# EAGLE design wt11i_breakout_board_v21 (EAGLE 6.5.0)
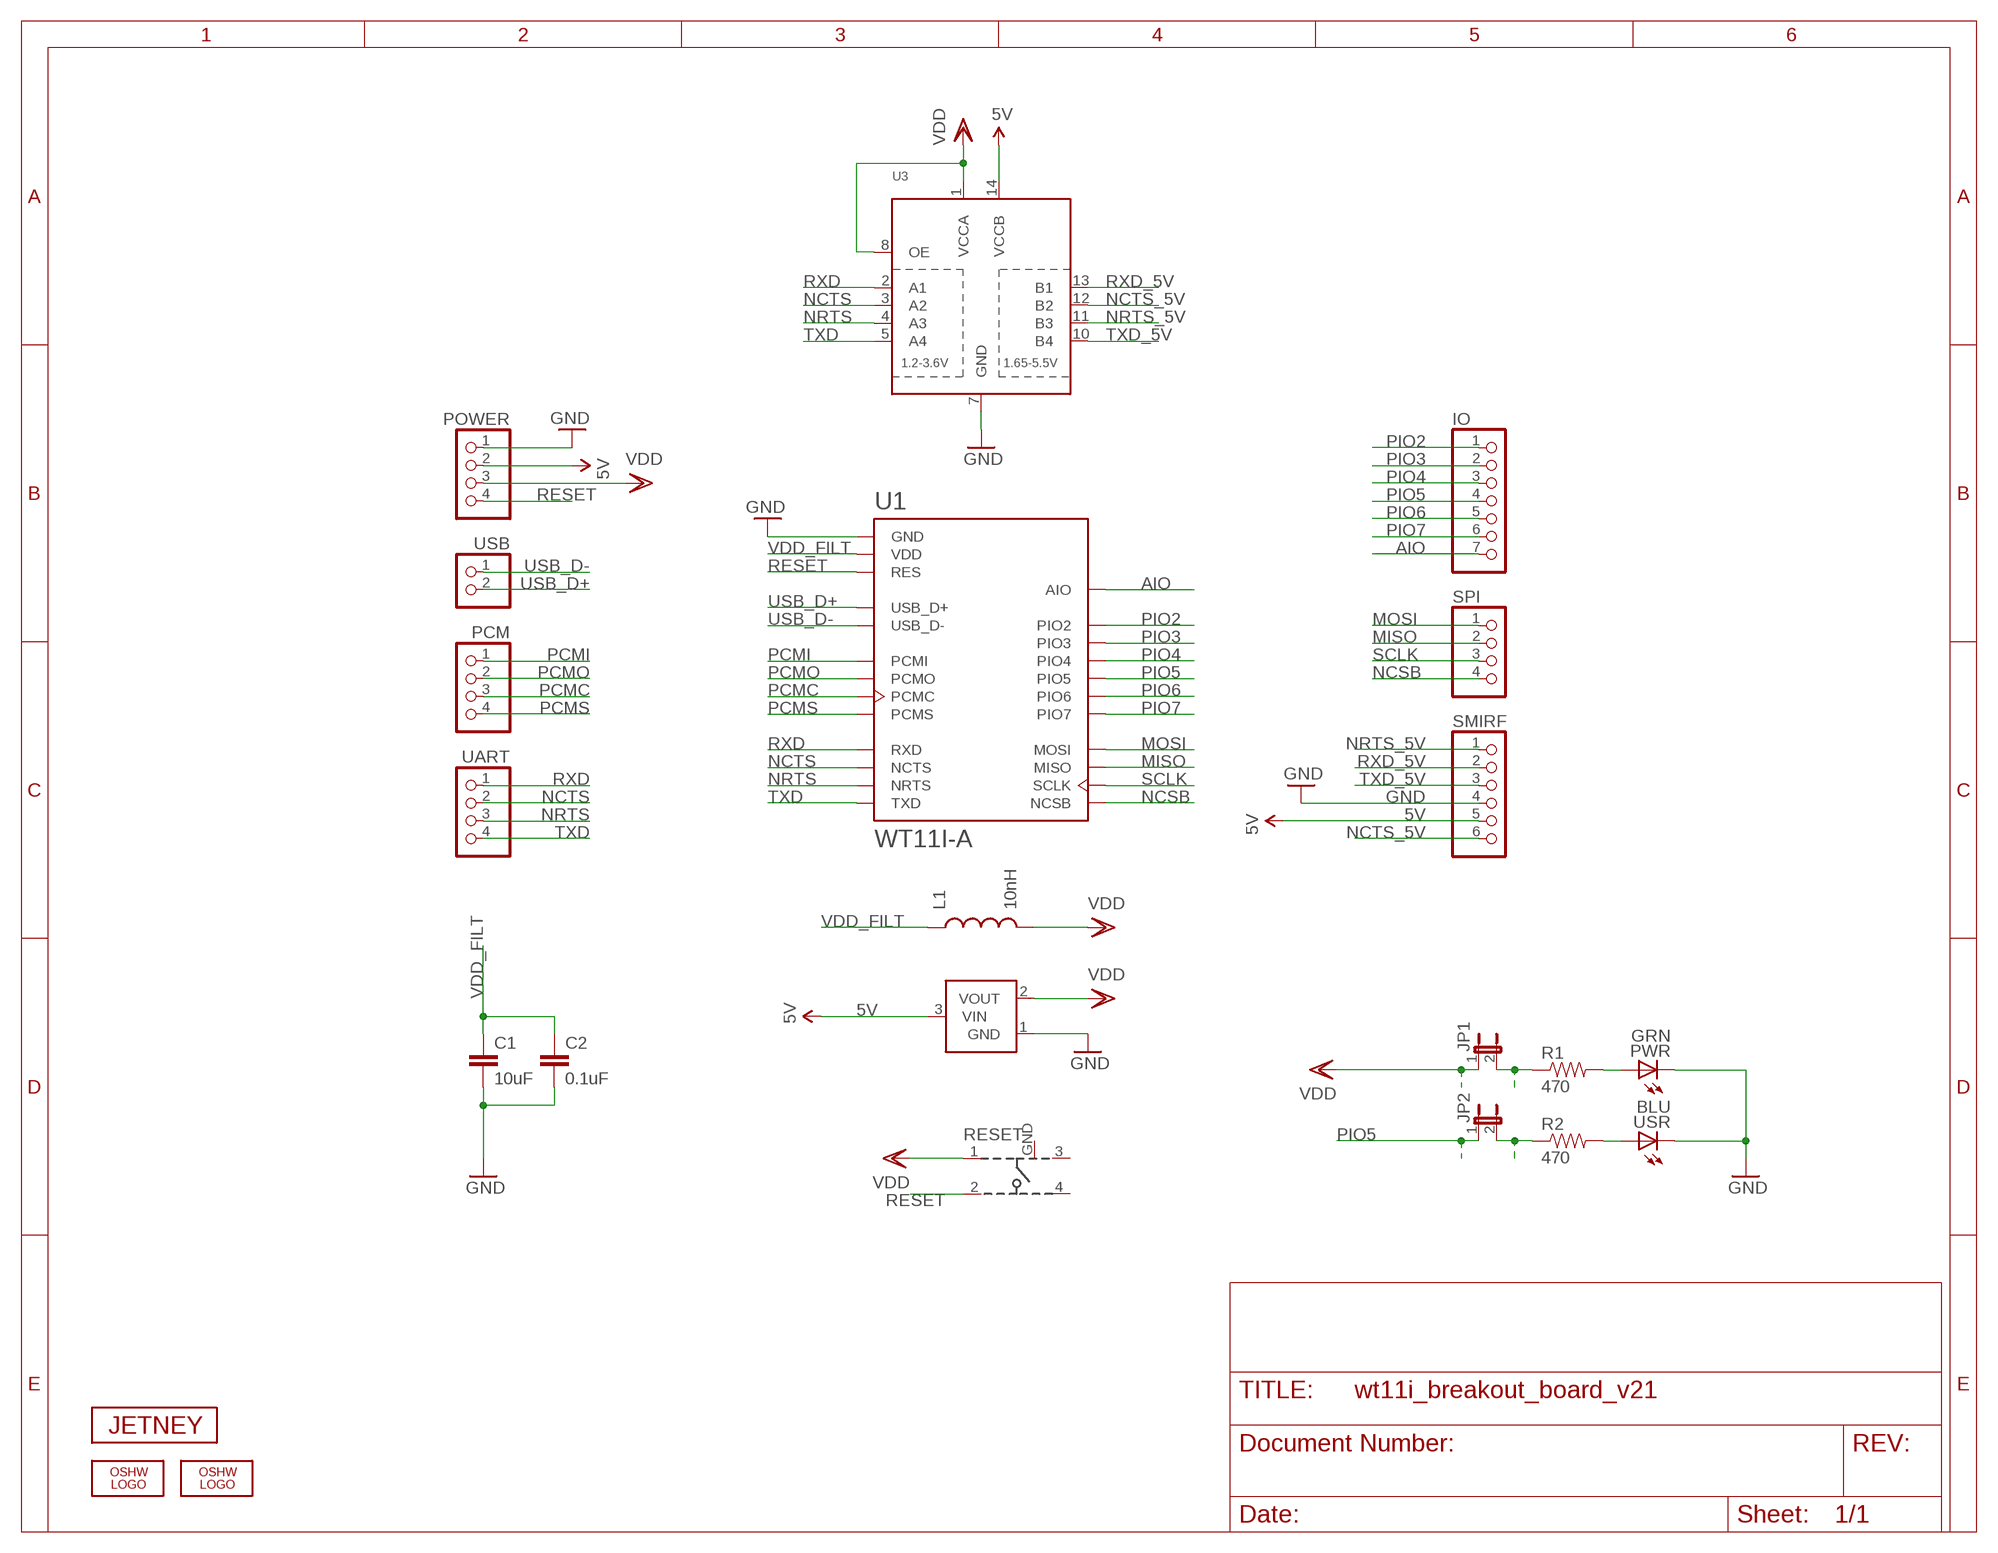
[diagram p0: schematic, sheet 1]

## Parts
C1  10uF  CAP0603-CAP  [0603-CAP]
C2  0.1uF  CAP0603-CAP  [0603-CAP]
IO  PINHD-1X7  [1X07]
JP1  JUMPER-2SMD-NC  [SJ_2S]
JP2  JUMPER-2SMD-NC  [SJ_2S]
L1  10nH  INDUCTOR0603  [0603]
LOGO1  OSHW_LOGO_FILLX0070-NT  [OSHW_FILLX70_NOTEXT]
LOGO3  OSHW_LOGO_FILLX0070-NT  [OSHW_FILLX70_NOTEXT]
PCM  PINHD-1X4  [1X04]
POWER  PINHD-1X4  [1X04]
PWR  GRN  LEDCHIPLED_0805  [CHIPLED_0805]
R1  470  RESISTOR0603-RES  [0603-RES]
R2  470  RESISTOR0603-RES  [0603-RES]
RESET  101-IG  [101-IG]
SMIRF  PINHD-1X6  [1X06]
SPI  PINHD-1X4  [1X04]
U1  WT11I-A  [WT11I-A]
U2  MCP1700  [SOT23-3]
U3  TXB0104PWR  [TSSOP14]
U$2  JETNEY-LOGO-12  [JETNEY-LOGO-12]
UART  PINHD-1X4  [1X04]
USB  PINHD-1X2  [1X02]
USR  BLU  LEDCHIPLED_0805  [CHIPLED_0805]

## Nets
5V [power]: POWER.2 SMIRF.5 U2.3(VIN) U3.14(VCCB)
AIO: IO.7 U1.AIO
GND [power]: C1.2 C2.2 POWER.1 PWR.C SMIRF.4 U1.GND U1.GND@2(GND) U1.GND@3(GND) U1.GND@4(GND) U2.1(GND) U3.7(GND) USR.C
MISO: SPI.2 U1.MISO
MOSI: SPI.1 U1.MOSI
N$1: PWR.A R1.2
N$3: R2.2 USR.A
N$4: JP2.2 R2.1
NCSB: SPI.4 U1.NCSB
NCTS: U1.NCTS U3.3(A2) UART.2
NCTS_5V: SMIRF.6 U3.12(B2)
NRTS: U1.NRTS U3.4(A3) UART.3
NRTS_5V: SMIRF.1 U3.11(B3)
PCMC: PCM.3 U1.PCMC
PCMI: PCM.1 U1.PCMI
PCMO: PCM.2 U1.PCMO
PCMS: PCM.4 U1.PCMS
PIO2: IO.1 U1.PIO2
PIO3: IO.2 U1.PIO3
PIO4: IO.3 U1.PIO4
PIO5: IO.4 JP2.1 U1.PIO5
PIO6: IO.5 U1.PIO6
PIO7: IO.6 U1.PIO7
RESET: POWER.4 RESET.2 U1.RES
RXD: U1.RXD U3.2(A1) UART.1
RXD_5V: SMIRF.2 U3.13(B1)
SCLK: SPI.3 U1.SCLK
TXD: U1.TXD U3.5(A4) UART.4
TXD_5V: SMIRF.3 U3.10(B4)
USB_D+: U1.USB_D+ USB.2
USB_D-: U1.USB_D- USB.1
VDD [power]: JP1.1 L1.2 POWER.3 RESET.1 U2.2(VOUT) U3.1(VCCA) U3.8(OE)
VDD_FILT [power]: C1.1 C2.1 L1.1 U1.VDD U1.VDD@2(VDD)
VDDJP1 [power]: JP1.2 R1.1
Unconnected: RESET.3 RESET.4

## Power pins joined to a net without a drawn wire
GND: RESET.GND

## Library data of the parts
C1 C2 = SparkFun:CAP: Capacitor Standard 0603 ceramic capacitor, and 0.1" leaded capacitor.
IO = sf-pinhead:PINHD-1X7: PIN HEADER
JP1 JP2 = SparkFun:JUMPER-2: Jumper Basic 0.1" spaced jumper. Use with breakaway headers.
L1 = SparkFun:INDUCTOR: Inductors Basic Inductor/Choke - 0603 and 1206. Footprints are not proven and vary greatly between part numbers.
LOGO1 LOGO3 = oshw-logo:OSHW_LOGO_FILL
PCM POWER SPI UART = sf-pinhead:PINHD-1X4: PIN HEADER
PWR USR = adafruit:LED: LED OSRAM: - CHIPLED LG R971, LG N971, LY N971, LG Q971, LY Q971, LO R971, LY R971 LH N974, LH R974 LS Q976, LO Q976, LY Q976 LO Q996 - Hyper CHIPLED LW Q18S LB Q993, LB Q99A, LB R99A - SideLED LS A670, LO A670, LY A670, LG A670, LP A670 LB A673, LV A673, LT A673, LW A673 LH A674 LY A675 LS A676, LA A676, LO A676, LY A676, LW A676 LS A679, LY A679, LG A679 - Hyper Micro SIDELED® LS Y876, LA Y876, LO Y876, LY Y876 LT Y87S - SmartLED LW L88C, LW L88S LB L89C, LB L89S, LG L890 LS L89K, LO L89K, LY L89K LS L896, LA L896, LO L896, LY L896 - TOPLED LS T670, LO T670, LY T670, LG T670, LP T670 LSG T670, LSP T670, LSY T670, LOP T670, LYG T670 LG T671, LOG T671, LSG T671 LB T673, LV T673, LT T673, LW T673 LH T674 LS T676, LA T676, LO T676, LY T676, LB T676, LH T676, LSB T676, LW T676 LB T67C, LV T67C, LT T67C, LS T67K, LO T67K, LY T67K, LW E67C LS E67B, LA E67B, LO E67B, LY E67B, LB E67C, LV E67C, LT E67C LW T67C LS T679, LY T679, LG T679 LS T770, LO T770, LY T770, LG T770, LP T770 LB T773, LV T773, LT T773, LW T773 LH T774 LS E675, LA E675, LY E675, LS T675 LS T776, LA T776, LO T776, LY T776, LB T776 LHGB T686 LT T68C, LB T68C - Hyper Mini TOPLED® LB M676 - Mini TOPLED Santana® LG M470 LS M47K, LO M47K, LY M47K Source: http://www.osram.convergy.de/
R1 R2 = SparkFun:RESISTOR: Resistor Basic schematic elements and footprints for 0603, 1206, and PTH resistors.
RESET = sf-keyglove:101-IG
SMIRF = sf-pinhead:PINHD-1X6: PIN HEADER
U1 = sf-bluegiga:WT11I: Bluegiga WT11i class 1 Bluetooth 2.1 + EDR module. WT11i-A variant has an on-module ceramic chip antenna, WT11i-E variant has a U.Fl connector. WT11i-A variant includes keepout/restrict area. Antenna edge of the module should be flush up against the edge of the PCB. See datasheet for variant layout details. The WT11i is a fully integrated Bluetooth 2.1 + EDR, class 1 module combining antenna, Bluetooth radio, and an on-board iWRAP Bluetooth stack. Bluegiga's WT11i constitutes the ideal solution for developers that want to quickly integrate long-range and high-performance Bluetooth wireless technology into their design without investing several months in Bluetooth radio and stack development. It provides a 100dB link budget ensuring long range and robust Bluetooth connectivity and uses Bluegiga's iWRAP Bluetooth stack, which is an embedded Bluetooth stack implementing 13 different Bluetooth profiles and Apple iAP connectivity. By using WT11i combined with iWRAP Bluetooth stack and Bluegiga's excellent technical support, designers ensure quick time-to-market and low development costs and risks. http://www.bluegiga.com/en-US/products/bluetooth-classic-modules/wt11i-bluetooth-class-1-module https://github.com/jrowberg/sf-oshw Last updated 2014-01-04 by Jeff Rowberg <jeff@rowberg.net>; ANTENNA: On-module ceramic chip antenna
U2 = nonolith:MCP1700: Voltage regulator
U3 = SparkFun-DigitalIC:TXB0104PWR: 4-Bit Bi-Directional Level Shifter 1.2V-3.6V (VCCA) to 1.65V-5.5V (VCCB) bi-directional level shifter with auto direction sensing. Max data rate - VCCA 1.8V: 20Mbps (50ns), VCCA 3.3V: 100Mbps (10ns) Digikey: 296-21929-1-ND (TSSOP) IC-11329
U$2 = sf-keyglove:JETNEY-LOGO
USB = sf-pinhead:PINHD-1X2: PIN HEADER

## Net classes
0 default: width 0.152 mm, drill 0.33 mm, clearance 0.152 mm
1 power: width 0.254 mm, drill 0.33 mm, clearance 0.152 mm

## Board
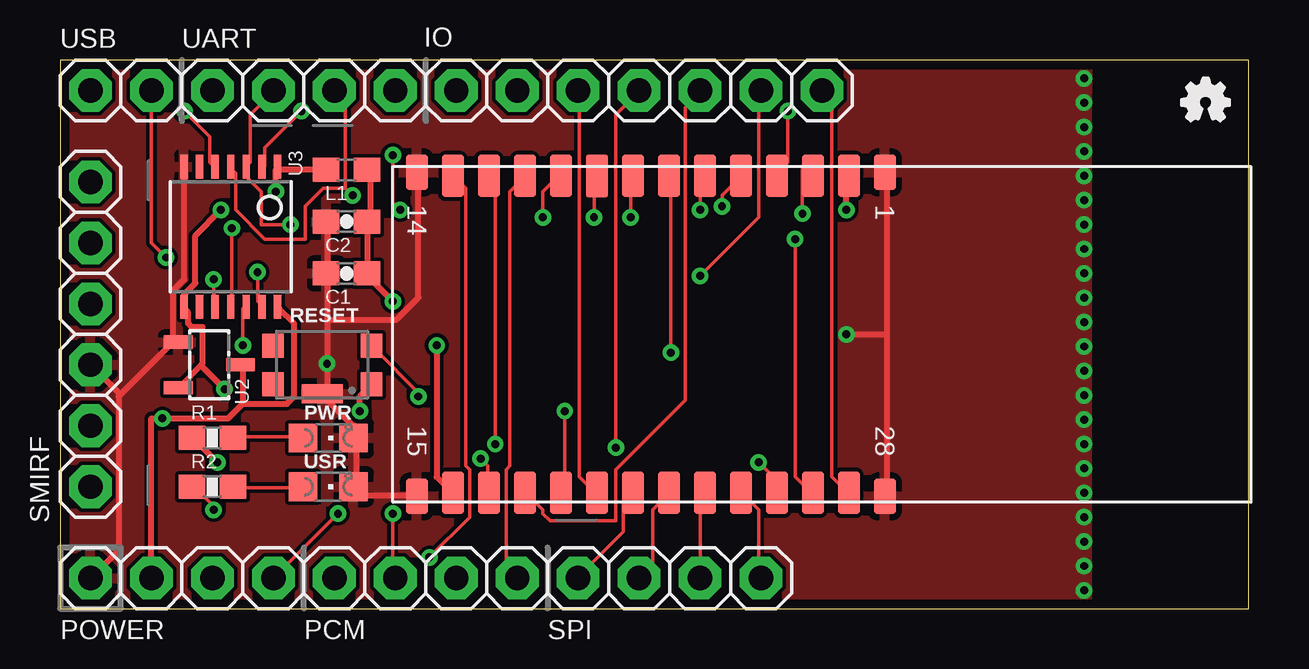
[diagram p1: board, top side]
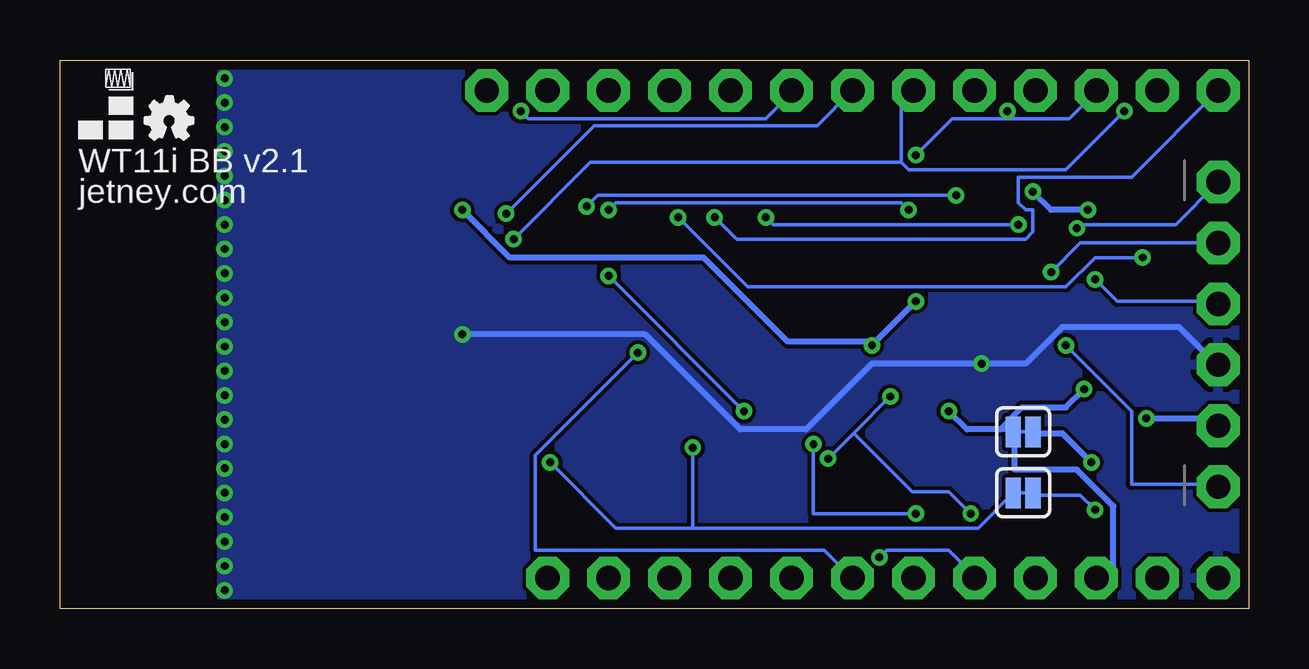
[diagram p2: board, bottom side, seen from below]

Size 49.53 x 22.86 mm. Coordinates in mm from the lower left corner, seen from the top.
Outline: 0,0 49.53,0 49.53,22.86 0,22.86 0,0
Copper layers (1*16): Top 0.0356mm / dielectric 1.5011mm / Bottom 0.0356mm
Design rules "LaenPCBOrder *": minimum track width 6mil, minimum drill 13mil, track to track 6mil, track to pad 6mil, pad to pad 6mil, via to via 6mil, smd to smd 6mil, copper to edge 15mil, drill to drill 6mil, minimum pad ring 7mil, minimum via ring 7mil, stop-mask expansion 4mil, vias tented up to drill 13mil, thermal gap 10mil
vRestrict: area 0,19.3 to 33,20.3; area 0,2.5 to 30.5,3.6; area 2.5,3.8 to 3.8,19.1; area 10.2,5.8 to 11.7,6.3; area 10.2,7.9 to 11.7,8.4

### Footprints (pad centres in the part's own frame; a part is rotated, then mirrored left to right if it is on the bottom)
0603-CAP = smd 1.1 x 1: 1 -0.85,0; 2 0.85,0
1X07 = drill 1.016 pad 1.778 octagon: 1 -7.62,0; 2 -5.08,0; 3 -2.54,0; 4 0,0; 5 2.54,0; 6 5.08,0; 7 7.62,0
SJ_2S = smd 0.635 x 1.27: 1 -0.412,0; 2 0.412,0
0603 = smd 1.1 x 1: 1 -0.85,0; 2 0.85,0
1X04 = drill 1.016 pad 1.778 octagon: 1 -3.81,0; 2 -1.27,0; 3 1.27,0; 4 3.81,0
CHIPLED_0805 = smd 1.2 x 1.2: A 0,-1.05; C 0,1.05
0603-RES = smd 1.1 x 1: 1 -0.85,0; 2 0.85,0
101-IG = smd 0.9 x 1: 1 -2.05,0.8; 2 -2.05,-0.8; 3 2.05,0.8; 4 2.05,-0.8 | smd 1.7 x 0.8: GND 0,1.2
1X06 = drill 1.016 pad 1.778 octagon: 1 -6.35,0; 2 -3.81,0; 3 -1.27,0; 4 1.27,0; 5 3.81,0; 6 6.35,0
WT11I-A = smd 1.778 x 0.914: AIO 6.6,1.12; MISO 6.6,-4.88; MOSI 6.6,-3.38; NCSB 6.6,-7.88; NCTS -6.6,-10.88; NRTS -6.6,-3.38; PCMC -6.6,-13.88; PCMI -6.6,-12.38; PCMO -6.6,-6.38; PCMS -6.6,-15.38; PIO2 -6.6,-0.38; PIO3 -6.6,-1.88; PIO4 6.6,-9.38; PIO5 6.6,-1.88; PIO6 6.6,-12.38; PIO7 6.6,-10.88; RES 6.6,-13.88; RXD -6.6,-4.88; SCLK 6.6,-6.38; TXD 6.6,-0.38; USB_D+ -6.6,-7.88; USB_D- -6.6,-9.38; VDD -6.6,1.12; VDD@2 6.6,-15.38 | smd 1.478 x 0.914: GND -6.75,2.62; GND@2 -6.75,-16.88; GND@3 6.75,-16.88; GND@4 6.75,2.62
SOT23-3 = smd 0.55 x 1.2: 1 0.95,1.3; 2 -0.95,1.3; 3 0,-1.3
TSSOP14 = smd 0.305 x 0.991: 1 -1.95,-2.918; 2 -1.3,-2.918; 3 -0.65,-2.918; 4 0,-2.918; 5 0.65,-2.918; 6 1.3,-2.918; 7 1.95,-2.918; 8 1.95,2.918; 9 1.3,2.918; 10 0.65,2.918; 11 0,2.918; 12 -0.65,2.918; 13 -1.3,2.918; 14 -1.95,2.918
1X02 = drill 1.016 pad 1.778 octagon: 1 -1.27,0; 2 1.27,0

### Placement (x,y rotation side)
C1  11.94,13.97 180 top
C2  11.94,16.13 180 top
IO  24.13,21.59 0 top
JP1  9.4,7.37 0 bottom
JP2  9.4,4.83 0 bottom
L1  11.94,18.29 180 top
LOGO1  46.74,20.32 0 top
LOGO3  45.97,19.56 0 bottom
PCM  15.24,1.27 180 top
POWER  5.08,1.27 0 top
PWR  11.18,7.11 270 top
R1  6.35,7.11 0 top
R2  6.35,5.08 0 top
RESET  10.92,10.16 180 top
SMIRF  1.27,11.43 270 top
SPI  25.4,1.27 180 top
U1  31.75,11.43 270 top
U2  6.22,10.16 90 top
U3  7.11,15.49 180 top
U$2  48.77,19.56 0 bottom
UART  10.16,21.59 0 top
USB  2.54,21.59 0 top
USR  11.18,5.08 270 top

### Tracks (layer width: path | path; a pad name or v marks a point on that pad's centre or on a via)
5V  (via drill 0.33)
  Top 0.254: 7.62,8.53 9.45,8.53 9.75,8.84 9.75,11.89 9.14,12.5 U3.14 | 7.62,8.53 7.62,10.06 U2.3 | 7.62,8.53 7.01,7.92 v4.27,7.92 3.81,7.92 POWER.2
  Bottom 0.254: v4.27,7.92 1.68,7.92 1.37,7.62 SMIRF.5
AIO
  Top 0.152: IO.7 32.16,21.18 32.16,5.49 32.77,4.88 U1.AIO
GND  (via drill 0.33)
  Top 0.254: 14.94,4.72 U1.GND@3 14.78,4.72 12.34,4.72 12.34,5.03 USR.C 12.34,5.18 12.34,7.01 PWR.C 12.19,7.16 12.19,7.62 10.97,8.84 RESET.GND 10.97,8.99 11.12,9.14 v11.12,10.21 11.12,12.04 | 14.94,18.29 U1.GND@2 14.94,18.14 14.94,12.95 14.02,12.04 11.12,12.04 | C2.2 11.12,16 11.12,14.02 C1.2 11.12,13.87 11.12,12.04 | 34.44,11.43 34.44,18.14 U1.GND 34.44,18.29 | 34.44,11.43 34.44,4.72 U1.GND@4 | U3.7 5.18,18.29 5.18,13.72 4.72,13.26 4.72,11.28 4.88,11.12 U2.1 | 5.03,11.12 U2.1 | POWER.1 2.44,2.44 2.44,8.84 | 2.44,8.84 2.44,8.99 SMIRF.4 | 2.44,8.84 4.72,11.12 U2.1 | v32.77,11.43 34.44,11.43
  Bottom 0.254: v32.77,11.43 25.15,11.43 21.18,7.47 18.44,7.47 15.7,10.21 v11.12,10.21 9.3,10.21 7.77,11.73 2.9,11.73 1.37,10.21 SMIRF.4
  other vias: 42.67,21.08 42.67,22.1 42.67,20.07 42.67,19.05 42.67,18.03 42.67,17.02 42.67,16 42.67,14.99 42.67,13.97 42.67,12.95 42.67,11.94 42.67,10.92 42.67,9.91 42.67,8.89 42.67,7.87 42.67,6.86 42.67,5.84 42.67,4.83 42.67,3.81 42.67,2.79 42.67,1.78 42.67,0.76
  pour Top: 0,22.86 42.8,22.86 42.8,0 0,0
  pour Bottom: 0,22.86 42.8,22.86 42.8,0 0,0
MISO
  Top 0.152: SPI.2 26.67,4.57 26.82,4.72 U1.MISO
MOSI
  Top 0.152: U1.MOSI 28.5,4.72 29.11,4.12 29.11,1.37 SPI.1
N$1
  Top 0.152: R1.2 7.32,7.16 10.06,7.16 PWR.A
N$3
  Top 0.152: R2.2 7.32,5.03 10.06,5.03 USR.A
N$4  (via drill 0.33)
  Top 0.152: v6.4,4.12 6.4,4.27 5.64,5.03 R2.1
  Bottom 0.152: v6.4,4.12 7.01,4.72 8.84,4.72 JP2.2
N$5
  Bottom 0.152: 9.14,4.83 9.65,4.83
N$6
  Bottom 0.152: 9.14,7.37 9.65,7.37
NCSB
  Top 0.152: U1.NCSB 23.77,4.72 23.47,4.42 23.47,3.2 21.64,1.37 SPI.4
NCTS  (via drill 0.33)
  Top 0.152: UART.2 8.84,21.49 7.92,20.57 7.92,18.59 7.77,18.44 U3.3 7.77,18.29 7.77,17.98 8.38,17.37 8.38,16 v9.6,16 | v20.12,16.31 20.12,17.37 20.73,17.98 U1.NCTS
  Bottom 0.152: v20.12,16.31 19.81,16 v9.6,16
NCTS_5V  (via drill 0.33)
  Top 0.152: v7.62,10.97 7.62,12.5 U3.12
  Bottom 0.152: v7.62,10.97 4.88,8.23 4.88,5.18 1.37,5.18 SMIRF.6
NRTS  (via drill 0.33)
  Top 0.152: 11.89,17.53 10.97,17.53 10.21,16.76 10.21,15.39 8.53,15.39 7.32,16.61 7.32,18.14 7.16,18.29 U3.4 | 11.89,17.53 11.89,21.03 11.43,21.49 UART.3 | v27.58,16.76 27.58,17.22 28.35,17.98 U1.NRTS | 11.89,17.53 v12.19,17.22
  Bottom 0.152: v27.58,16.76 27.13,17.22 v12.19,17.22
NRTS_5V  (via drill 0.33)
  Top 0.152: v7.16,15.85 7.16,12.65 U3.11
  Bottom 0.152: v7.16,15.85 7.01,16 3.05,16 SMIRF.1
PCMC  (via drill 0.33)
  Top 0.152: v18.14,6.86 18.14,17.83 17.98,17.98 U1.PCMC | v13.87,3.96 13.87,1.37 PCM.3
  Bottom 0.152: v18.14,6.86 18.14,3.96 v13.87,3.96
PCMI
  Top 0.152: U1.PCMI 19.36,17.98 18.75,17.37 18.75,5.94 18.59,5.79 18.59,1.83 19.05,1.37 PCM.1
PCMO  (via drill 0.33)
  Top 0.152: v25.45,10.67 25.45,17.98 U1.PCMO
  Bottom 0.152: v25.45,10.67 29.72,6.4 29.72,2.44 17.68,2.44 PCM.2
PCMS  (via drill 0.33)
  Top 0.152: v15.39,2.13 17.07,3.81 17.07,5.79 16.92,5.94 16.92,17.53 16.46,17.98 U1.PCMS
  Bottom 0.152: v15.39,2.13 15.09,2.44 12.5,2.44 11.43,1.37 PCM.4
PIO2  (via drill 0.33)
  Top 0.152: v30.94,16.46 30.94,18.44 31.24,18.14 U1.PIO2
  Bottom 0.152: v30.94,16.46 27.28,20.12 17.98,20.12 IO.1
PIO3  (via drill 0.33)
  Top 0.152: v30.33,20.73 30.33,18.59 29.87,18.14 U1.PIO3
  Bottom 0.152: v30.33,20.73 30.02,20.42 20.12,20.42 19.05,21.49 IO.2
PIO4
  Top 0.152: U1.PIO4 22.25,4.88 21.64,5.49 21.64,21.49 IO.3
PIO5  (via drill 0.33)
  Top 0.152: v29.11,6.1 29.72,5.49 29.72,4.88 U1.PIO5 | v23.16,6.71 23.16,20.57 24.08,21.49 IO.4
  Bottom 0.152: 23.16,3.35 26.36,3.35 v29.11,6.1 | 23.16,3.35 11.28,3.35 9.91,4.72 JP2.1 | 23.16,3.35 v23.16,6.71
PIO6
  Top 0.152: U1.PIO6 19.51,4.72 20.12,4.12 20.12,3.96 20.42,3.66 23.16,3.66 23.16,5.79 26.06,8.69 26.06,20.88 26.67,21.49 IO.5
PIO7  (via drill 0.33)
  Top 0.152: v21.03,8.23 21.03,5.03 20.88,4.88 U1.PIO7 | v26.67,13.87 29.11,16.31 29.11,21.49 IO.6
  Bottom 0.152: v26.67,13.87 v21.03,8.23
RESET  (via drill 0.33)
  Top 0.152: v14.94,8.84 14.94,8.99 13.11,10.82 RESET.2 | v17.53,6.25 17.83,5.94 17.83,4.88 U1.RES | v11.58,3.96 POWER.4
  Bottom 0.152: v17.53,6.25 16.46,7.32 | 16.46,7.32 v14.94,8.84 | v11.58,3.96 12.5,4.88 14.02,4.88 16.46,7.32
RXD  (via drill 0.33)
  Top 0.152: v10.06,20.73 8.53,19.2 8.53,18.44 U3.2 | v26.67,16.61 26.67,17.83 26.82,17.98 U1.RXD | v14.17,16.61 13.87,16.92 v13.87,18.9
  Bottom 0.152: 9.75,20.42 v10.06,20.73 | 9.75,20.42 7.47,20.42 6.4,21.49 UART.1 | v26.67,16.61 26.36,16.92 14.48,16.92 v14.17,16.61 | v13.87,18.9 12.34,20.42 9.75,20.42
RXD_5V  (via drill 0.33)
  Top 0.152: v8.23,14.02 8.23,12.8 8.38,12.65 U3.13
  Bottom 0.152: v8.23,14.02 7.01,15.24 SMIRF.2
SCLK
  Top 0.152: SPI.3 24.69,1.83 24.69,4.12 25.3,4.72 U1.SCLK
TXD  (via drill 0.33)
  Top 0.152: v5.18,20.73 6.25,19.66 6.25,18.59 6.4,18.44 U3.5 | v30.63,15.39 30.63,5.49 31.24,4.88 U1.TXD
  Bottom 0.152: v5.18,20.73 7.62,18.29 14.17,18.29 14.48,18.59 | 14.48,18.59 14.48,21.49 14.02,21.49 UART.4 | v30.63,15.39 27.43,18.59 14.48,18.59
TXD_5V  (via drill 0.33)
  Top 0.152: v6.4,13.72 6.4,12.65 U3.10
  Bottom 0.152: v6.4,13.72 5.49,12.8 1.37,12.8 SMIRF.3
USB_D+  (via drill 0.33)
  Top 0.152: v23.77,16.31 23.77,17.98 U1.USB_D+ | v4.42,14.63 3.81,15.24 USB.2
  Bottom 0.152: v23.77,16.31 20.88,13.41 7.62,13.41 6.4,14.63 v4.42,14.63
USB_D-  (via drill 0.33)
  Top 0.152: v22.25,16.31 22.25,17.98 U1.USB_D-
  Bottom 0.152: v22.25,16.31 21.34,15.39 9.3,15.39 8.99,15.7 8.99,16.61 9.3,16.61 9.6,16.92 9.6,17.98 4.88,17.98 USB.1
VDD  (via drill 0.33)
  Top 0.254: L1.2 9.14,18.29 U3.1 8.99,18.29 v8.99,17.37 | 5.87,10.13 5.03,9.3 U2.2 | 5.87,10.13 5.94,10.21 5.94,11.73 5.49,11.73 5.33,11.89 5.33,12.34 5.18,12.5 U3.8 5.18,12.65 5.18,13.11 5.64,13.56 5.64,15.54 v6.71,16.61 | v12.5,8.23 12.5,8.84 12.95,9.3 RESET.1 | v6.86,9.14 5.87,10.13
  Bottom 0.254: v8.99,17.37 8.23,16.61 v6.71,16.61 | v12.5,8.23 11.73,7.47 10.36,7.47 | 10.36,7.47 9.91,7.47 JP1.1 9.75,7.32 9.75,5.79 7.16,5.79 5.64,4.27 5.64,1.37 6.25,1.37 POWER.3 | v6.86,9.14 7.62,8.38 9.45,8.38 10.36,7.47
VDD_FILT  (via drill 0.33)
  Top 0.254: L1.1 12.8,18.29 12.95,18.14 12.95,16.31 12.8,16.15 C2.1 12.8,16 12.8,14.02 C1.1 12.8,13.87 v13.87,12.8 | v15.7,10.97 15.7,5.49 16.31,4.88 U1.VDD@2 | v32.77,16.61 32.77,17.98 U1.VDD
  Bottom 0.254: v13.87,12.8 v15.7,10.97 15.7,11.12 19.2,11.12 22.71,14.63 30.79,14.63 v32.77,16.61
VDDJP1  (via drill 0.33)
  Top 0.254: v6.55,6.1 5.64,7.01 R1.1
  Bottom 0.254: v6.55,6.1 7.77,7.32 8.84,7.32 JP1.2

### Text on the board
bPlace: WT11i BB v2.1 | jetney.com
tDocu: D- D+ | RTS RXD TXD GND VCC CTS | RXD CTS RTS TXD | P2 P3 P4 P5 P6 P7 | AIO | Bluegiga / WT11i-A | GND 3V3 RES SYN CLK OUT CSB SCK | 5V | IN | MISO | MOSI
bDocu: RTS RXD TXD GND VCC CTS | PWR | PIO5